# EAGLE schematic Apple ii SCSI VDEV2 (EAGLE 9.6.2)
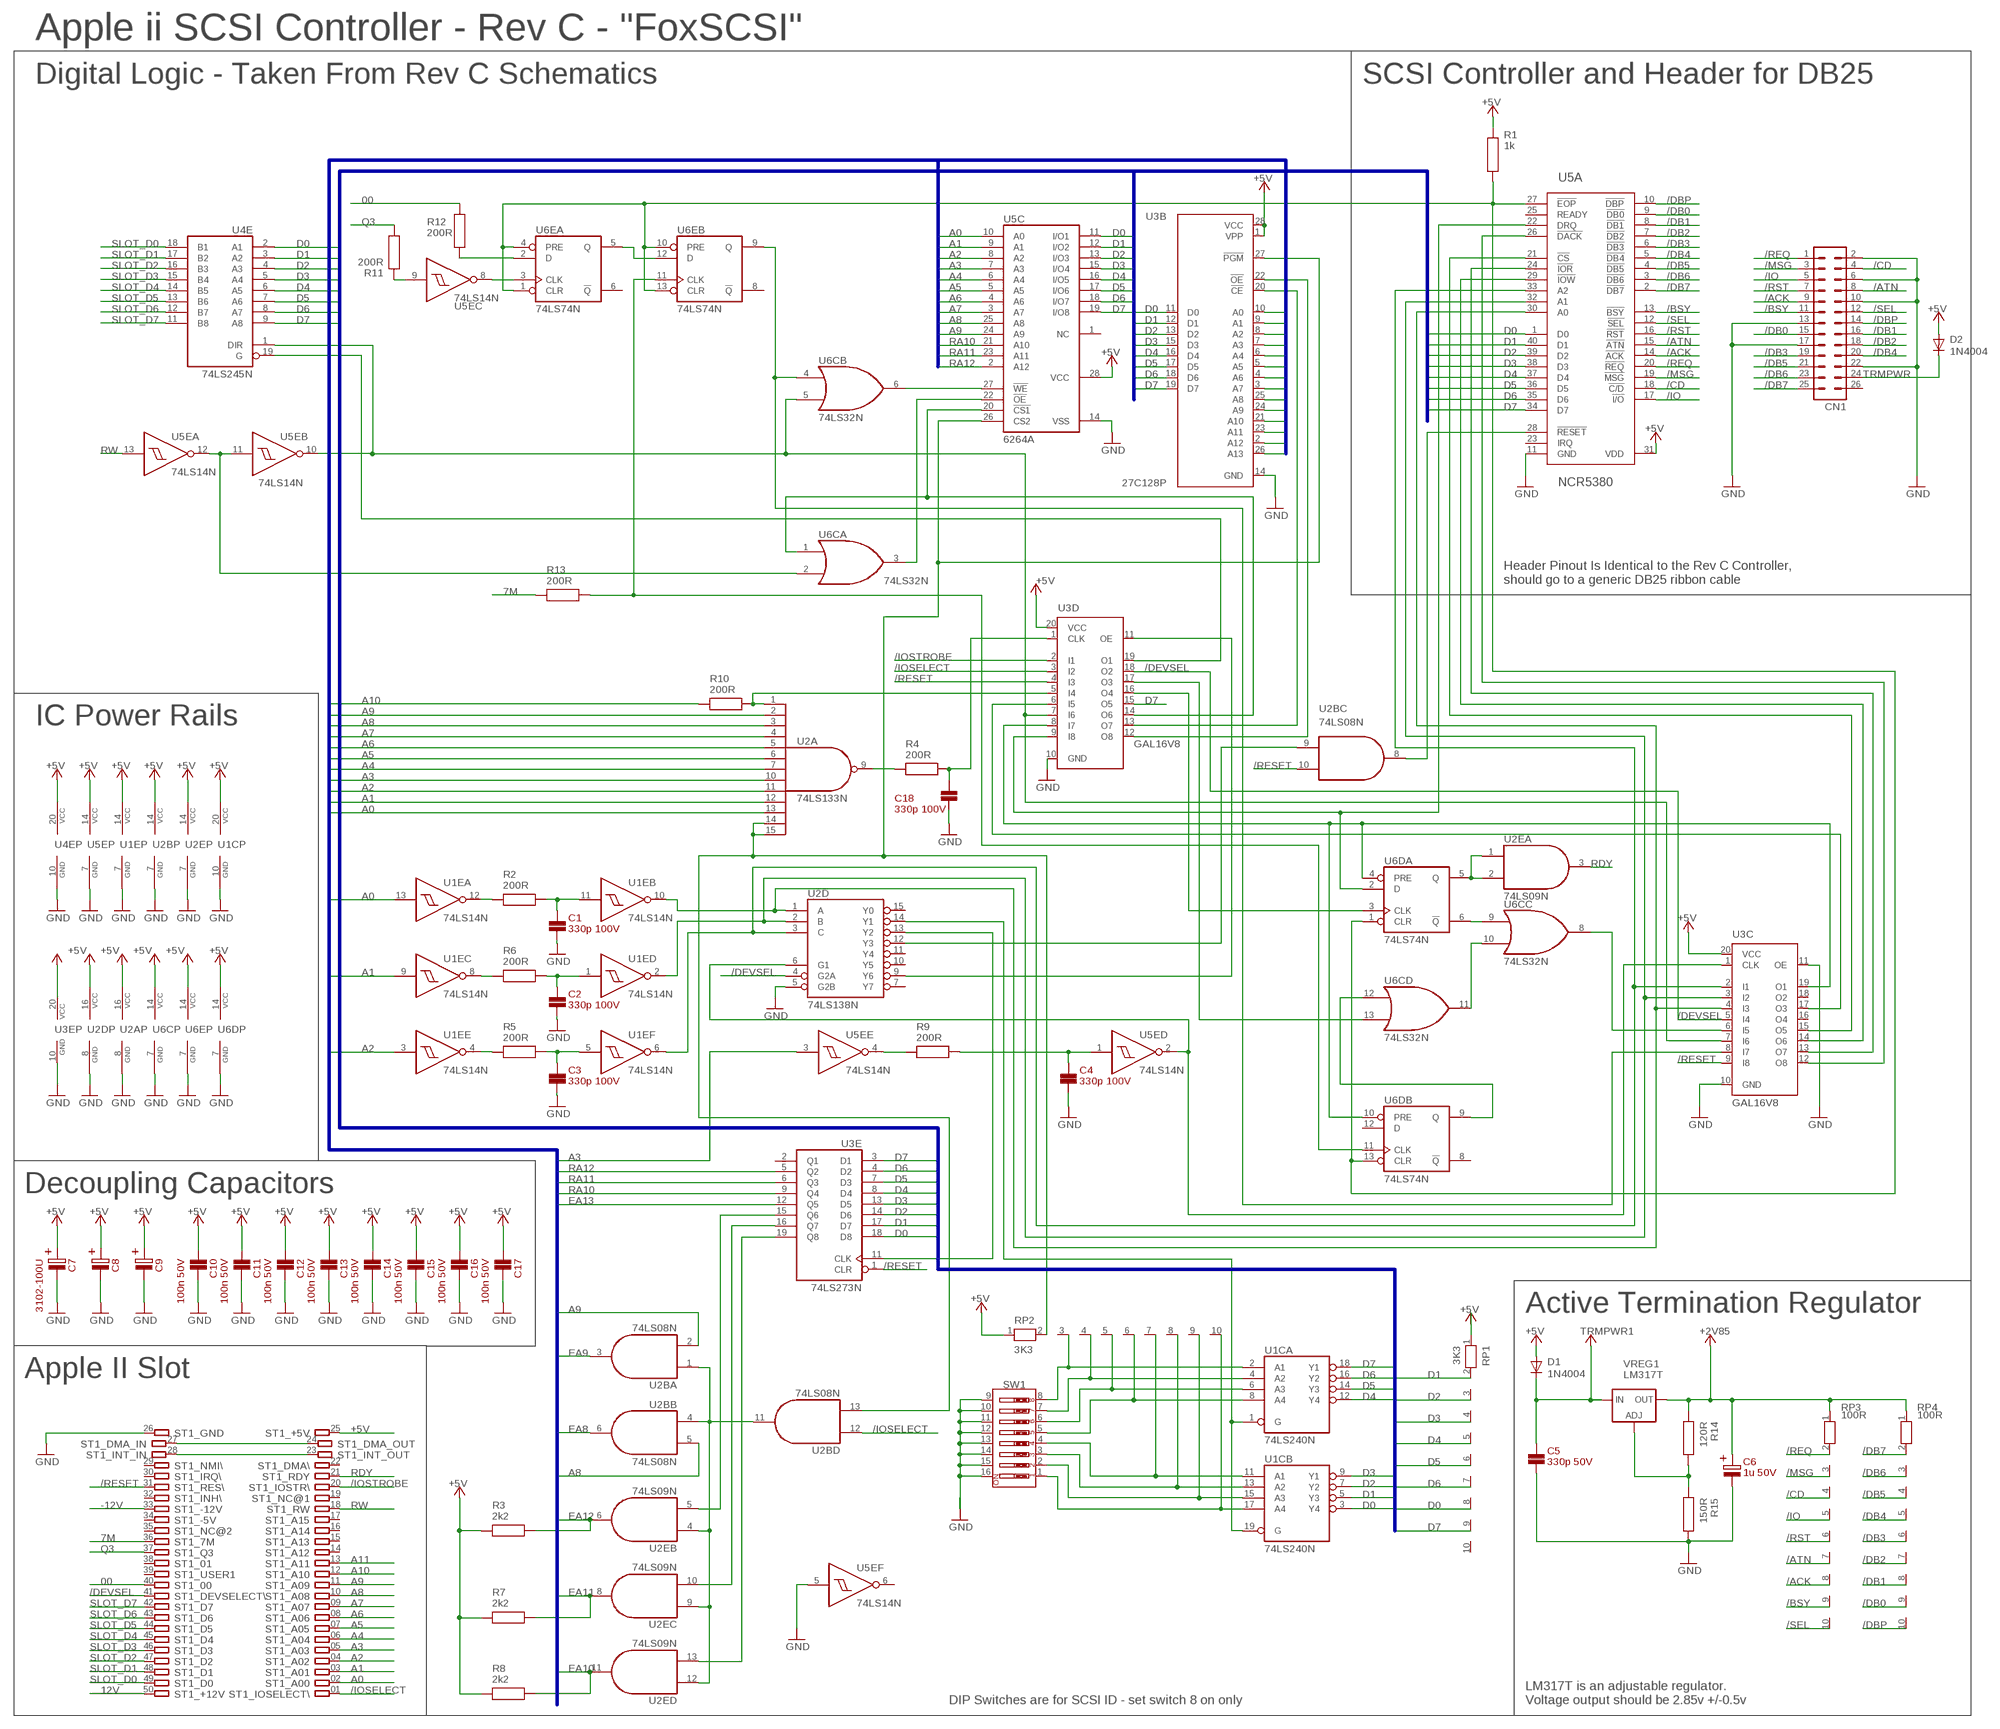
[diagram p0: schematic, sheet 1, part 1 of 2]
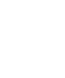
[diagram p1: schematic, sheet 1, part 2 of 2]

## Parts
C1  330p 100V  33P_TH_CAP  [CAP_5.08MM_PITCH]
C2  330p 100V  33P_TH_CAP  [CAP_5.08MM_PITCH]
C3  330p 100V  33P_TH_CAP  [CAP_5.08MM_PITCH]
C4  330p 100V  33P_TH_CAP  [CAP_5.08MM_PITCH]
C5  330p 50V  330P_TH_CAP  [CAP_5.08MM_PITCH]
C6  1u 50V  1U_TH_ELEC_CAPHORIZONTAL  [CAP_ELECTROLYTIC_FLAT]
C7  3102-100U  100U_TH_ELEC_CAPHORIZONTAL  [CAP_ELECTROLYTIC_FLAT]
C8  10U_TH_ELEC_CAPHORIZONTAL  [CAP_ELECTROLYTIC_FLAT]
C9  10U_TH_ELEC_CAPHORIZONTAL  [CAP_ELECTROLYTIC_FLAT]
C10  100n 50V  100N_TH_CAP  [CAP_5.08MM_PITCH]
C11  100n 50V  100N_TH_CAP  [CAP_5.08MM_PITCH]
C12  100n 50V  100N_TH_CAP  [CAP_5.08MM_PITCH]
C13  100n 50V  100N_TH_CAP  [CAP_5.08MM_PITCH]
C14  100n 50V  100N_TH_CAP  [CAP_5.08MM_PITCH]
C15  100n 50V  100N_TH_CAP  [CAP_5.08MM_PITCH]
C16  100n 50V  100N_TH_CAP  [CAP_5.08MM_PITCH]
C17  100n 50V  100N_TH_CAP  [CAP_5.08MM_PITCH]
C18  330p 100V  33P_TH_CAP  [CAP_5.08MM_PITCH]
CN1  MA13-2  [MA13-2]
D1  1N4004  [DO41-10]
D2  1N4004  [DO41-10]
R1  1k  1K_TH_RESISTOR  [RESISTORTHRUHOLE]
R2  200R  100R_TH_RESISTOR  [RESISTORTHRUHOLE]
R3  2k2  2K2_TH_RESISTOR  [RESISTORTHRUHOLE]
R4  200R  100R_TH_RESISTOR  [RESISTORTHRUHOLE]
R5  200R  100R_TH_RESISTOR  [RESISTORTHRUHOLE]
R6  200R  100R_TH_RESISTOR  [RESISTORTHRUHOLE]
R7  2k2  2K2_TH_RESISTOR  [RESISTORTHRUHOLE]
R8  2k2  2K2_TH_RESISTOR  [RESISTORTHRUHOLE]
R9  200R  100R_TH_RESISTOR  [RESISTORTHRUHOLE]
R10  200R  100R_TH_RESISTOR  [RESISTORTHRUHOLE]
R11  200R  100R_TH_RESISTOR  [RESISTORTHRUHOLE]
R12  200R  100R_TH_RESISTOR  [RESISTORTHRUHOLE]
R13  200R  100R_TH_RESISTOR  [RESISTORTHRUHOLE]
R14  120R  100R_TH_RESISTOR  [RESISTORTHRUHOLE]
R15  150R  100R_TH_RESISTOR  [RESISTORTHRUHOLE]
RP1  3K3  RN09  [RN-10]
RP2  3K3  RN09  [RN-10]
RP3  100R  RN09  [RN-10]
RP4  100R  RN09  [RN-10]
ST1  A2-50PINMINI  [A2-50PIN-MINI]
SW1  DIP-08-PTH  [DIPSWITCH-08]
U1C  74LS240N  [DIL20]
U1E  74LS14N  [DIL14]
U2A  74LS133N  74S133N  [DIL16]
U2B  74LS08N  [DIL14]
U2D  74LS138N  [DIL16]
U2E  74LS09N  [DIL14]
U3B  27C128P  [DIL28-6]
U3C  GAL16V8  ATF16V8BP3  [DIL20]
U3D  GAL16V8  ATF16V8BP3  [DIL20]
U3E  74LS273N  74273N  [DIL20]
U4E  74LS245N  [DIL20]
U5A  NCR5380  [DIP40]
U5C  6264A  [DIL28-6]
U5E  74LS14N  [DIL14]
U6C  74LS32N  [DIL14]
U6D  74LS74N  [DIL14]
U6E  74LS74N  [DIL14]
VREG1  LM317T  LM317TL  [317TL]

## Nets
00: R12.P$2 ST1.40
7M: R13.P$1 ST1.36
12V: ST1.50
+2V85: C6.P$1 R14.P$1 RP3.1 RP4.1 VREG1.2(OUT) ; supply symbol labelled VCC
+5V: C7.P$1 C8.P$1 C9.P$1 C10.P$1 C11.P$1 C12.P$1 C13.P$1 C14.P$1 C15.P$1 C16.P$1 C17.P$1 D1.A D2.A R1.P$2 R3.P$1 R7.P$1 R8.P$1 RP1.1 RP2.1 ST1.25 U1C.20(P:VCC) U1E.14(P:VCC) U2A.16(VCC) U2B.14(P:VCC) U2D.16(VCC) U2E.14(P:VCC) U3B.1(VPP) U3B.28(VCC) U3C.20(VCC) U3D.20(VCC) U3E.20(VCC) U4E.20(VCC) U5A.31(VDD) U5C.28(VCC) U5E.14(P:VCC) U6C.14(P:VCC) U6D.14(P:VCC) U6E.14(P:VCC) ; supply symbol labelled VCC
-12V: ST1.33
/ACK: CN1.9 RP3.8 U5A.14(!ACK)
/ATN: CN1.8 RP3.7 U5A.15(!ATN)
/BSY: CN1.11 RP3.9 U5A.13(!BSY)
/CD: CN1.4 RP3.4 U5A.18(!C/D)
/DB0: CN1.15 RP4.9 U5A.9(!DB0)
/DB1: CN1.16 RP4.8 U5A.8(!DB1)
/DB2: CN1.18 RP4.7 U5A.7(!DB2)
/DB3: CN1.19 RP4.6 U5A.6(!DB3)
/DB4: CN1.20 RP4.5 U5A.5(!DB4)
/DB5: CN1.21 RP4.4 U5A.4(!DB5)
/DB6: CN1.23 RP4.3 U5A.3(!DB6)
/DB7: CN1.25 RP4.2 U5A.2(!DB7)
/DBP: CN1.14 RP4.10 U5A.10(!DBP)
/DEVSEL: ST1.41 U2D.4(G2A) U3C.5(I4) U3D.18(O2)
/IO: CN1.5 RP3.5 U5A.17(!I/O)
/IOSELECT: ST1.01 U2B.12(D:I0) U3D.3(I2)
/IOSTROBE: ST1.20 U3D.2(I1)
/MSG: CN1.3 RP3.3 U5A.19(!MSG)
/REQ: CN1.1 RP3.2 U5A.20(!REQ)
/RESET: ST1.31 U2B.10(C:I1) U3C.9(I8) U3D.4(I3) U3E.1(CLR)
/RST: CN1.7 RP3.6 U5A.16(!RST)
/SEL: CN1.12 RP3.10 U5A.12(!SEL)
A0: ST1.02 U1E.13(A:I) U2A.13(I10) U3B.10(A0) U5C.10(A0)
A1: ST1.03 U1E.9(C:I) U2A.12(I9) U3B.9(A1) U5C.9(A1)
A2: ST1.04 U1E.3(E:I) U2A.11(I8) U3B.8(A2) U5C.8(A2)
A3: ST1.05 U2A.10(I7) U3B.7(A3) U5C.7(A3) U5E.3(E:I)
A4: ST1.06 U2A.7(I6) U3B.6(A4) U5C.6(A4)
A5: ST1.07 U2A.6(I5) U3B.5(A5) U5C.5(A5)
A6: ST1.08 U2A.5(I4) U3B.4(A6) U5C.4(A6)
A7: ST1.09 U2A.4(I3) U3B.3(A7) U5C.3(A7)
A8: ST1.10 U2A.3(I2) U2B.5(B:I1) U5C.25(A8)
A9: ST1.11 U2A.2(I1) U2B.2(A:I1) U5C.24(A9)
A10: R10.P$1 ST1.12
A11: ST1.13
D0: RP1.8 U1C.3(B:Y4) U3B.11(D0) U3E.18(D8) U4E.2(A1) U5A.1(D0) U5C.11(I/O1)
D1: RP1.2 U1C.5(B:Y3) U3B.12(D1) U3E.17(D7) U4E.3(A2) U5A.40(D1) U5C.12(I/O2)
D2: RP1.3 U1C.7(B:Y2) U3B.13(D2) U3E.14(D6) U4E.4(A3) U5A.39(D2) U5C.13(I/O3)
D3: RP1.4 U1C.9(B:Y1) U3B.15(D3) U3E.13(D5) U4E.5(A4) U5A.38(D3) U5C.15(I/O4)
D4: RP1.5 U1C.12(A:Y4) U3B.16(D4) U3E.8(D4) U4E.6(A5) U5A.37(D4) U5C.16(I/O5)
D5: RP1.6 U1C.14(A:Y3) U3B.17(D5) U3E.7(D3) U4E.7(A6) U5A.36(D5) U5C.17(I/O6)
D6: RP1.7 U1C.16(A:Y2) U3B.18(D6) U3E.4(D2) U4E.8(A7) U5A.35(D6) U5C.18(I/O7)
D7: RP1.9 U1C.18(A:Y1) U3B.19(D7) U3D.15(O5) U3E.3(D1) U4E.9(A8) U5A.34(D7) U5C.19(I/O8)
EA8: U2B.6(B:O) U3B.25(A8)
EA9: U2B.3(A:O) U3B.24(A9)
EA10: R8.P$2 U2E.11(D:O) U3B.21(A10)
EA11: R7.P$2 U2E.8(C:O) U3B.23(A11)
EA12: R3.P$2 U2E.6(B:O) U3B.2(A12)
EA13: U3B.26(A13) U3E.12(Q5)
GND: C1.P$1 C2.P$1 C3.P$1 C4.P$1 C5.P$1 C6.P$2 C7.P$2 C8.P$2 C9.P$2 C10.P$2 C11.P$2 C12.P$2 C13.P$2 C14.P$2 C15.P$2 C16.P$2 C17.P$2 C18.P$1 CN1.2 CN1.6 CN1.10 CN1.13 CN1.17 CN1.22 R15.P$2 ST1.26 SW1.9 SW1.10 SW1.11 SW1.12 SW1.13 SW1.14 SW1.15 SW1.16 U1C.10(P:GND) U1E.7(P:GND) U2A.8(GND) U2B.7(P:GND) U2D.5(G2B) U2D.8(GND) U2E.7(P:GND) U3B.14(GND) U3C.10(GND) U3C.11(OE) U3D.10(GND) U3E.10(GND) U4E.10(GND) U5A.11(GND) U5C.14(VSS) U5E.5(F:I) U5E.7(P:GND) U6C.7(P:GND) U6D.7(P:GND) U6E.7(P:GND)
N$1: ST1.24 ST1.27
N$2: ST1.23 ST1.28
N$3: U5E.11(B:I) U5E.12(A:O) U6C.2(A:I1)
N$4: U2B.8(C:O) U5A.28(!RESET)
N$5: RP2.3 SW1.8 U1C.2(A:A1)
N$6: RP2.4 SW1.7 U1C.4(A:A2)
N$7: RP2.5 SW1.6 U1C.6(A:A3)
N$8: RP2.6 SW1.5 U1C.8(A:A4)
N$9: RP2.7 SW1.4 U1C.11(B:A1)
N$10: RP2.8 SW1.3 U1C.13(B:A2)
N$11: RP2.9 SW1.2 U1C.15(B:A3)
N$12: RP2.10 SW1.1 U1C.17(B:A4)
N$13: U2E.13(D:I1) U3E.19(Q8)
N$14: U2B.1(A:I0) U2B.4(B:I0) U2B.11(D:O) U2E.4(B:I0) U2E.9(C:I0) U2E.12(D:I0)
N$15: U2E.10(C:I1) U3E.16(Q7)
N$16: U2E.5(B:I1) U3E.15(Q6)
N$17: U1E.10(B:O) U2D.1(A) U3C.4(I3) U5A.30(A0)
N$18: U1E.2(D:O) U2D.2(B) U3C.3(I2) U5A.32(A1)
N$19: C18.P$2 R4.P$2 U3D.1(CLK)
N$20: C1.P$2 R2.P$2 U1E.11(B:I)
N$21: R2.P$1 U1E.12(A:O)
N$22: R6.P$1 U1E.8(C:O)
N$23: C2.P$2 R6.P$2 U1E.1(D:I)
N$24: C3.P$2 R5.P$2 U1E.5(F:I)
N$25: R5.P$1 U1E.4(E:O)
N$26: R9.P$1 U5E.4(E:O)
N$27: C4.P$2 R9.P$2 U5E.1(D:I)
N$28: R4.P$1 U2A.9(O)
N$29: R10.P$2 U2A.1(I0) U3D.5(I4)
N$30: U1E.6(F:O) U2D.3(C) U3C.2(I1) U5A.33(A2)
N$32: U3C.17(O3) U3D.6(I5)
N$33: U3C.8(I7) U6C.4(B:I0) U6E.9(B:Q)
N$34: U3C.19(O1) U3D.8(I7) U6D.4(A:PRE) U6D.10(B:PRE)
N$35: U3D.9(I8) U5A.22(DRQ) U6D.2(A:D)
N$36: U2D.9(Y6) U3D.11(OE)
N$37: U3B.22(!OE) U3D.12(O8)
N$38: U3B.20(!CE) U3D.13(O7)
N$39: U3D.14(O6) U5C.20(!CS1) U6C.1(A:I0)
N$40: U3D.16(O4) U6D.3(A:CLK)
N$41: U3D.17(O3) U6C.13(D:I1)
N$43: U3D.19(O1) U4E.19(G)
N$44: U2D.6(G1) U3C.1(CLK) U5E.2(D:O)
N$45: U2D.13(Y2) U3E.11(CLK)
N$46: U2B.9(C:I0) U2D.12(Y3)
N$47: U1C.1(A:G) U1C.19(B:G) U2D.14(Y1)
N$48: U2E.1(A:I0) U2E.2(A:I1) U6D.5(A:Q)
N$49: U3C.6(I5) U6C.8(C:O)
N$50: U6C.9(C:I0) U6D.6(A:!Q)
N$51: U6C.10(C:I1) U6C.11(D:O)
N$52: U6C.12(D:I0) U6D.9(B:Q)
N$53: R1.P$1 U5A.27(!EOP) U6D.1(A:CLR) U6D.13(B:CLR) U6E.1(A:CLR) U6E.4(A:PRE) U6E.10(B:PRE) U6E.13(B:CLR)
N$54: R13.P$2 U6D.11(B:CLK) U6E.11(B:CLK)
N$55: R11.P$2 U5E.9(C:I)
N$56: U3C.14(O6) U5A.29(!IOW)
N$57: U3C.13(O7) U5A.24(!IOR)
N$58: U3C.12(O8) U5A.26(!DACK)
N$59: U3C.7(I6) U3D.7(I6) U4E.1(DIR) U5E.10(B:O) U6C.5(B:I1)
N$60: U3C.15(O5) U5A.21(!CS)
N$61: U5E.8(C:O) U6E.3(A:CLK)
N$62: R12.P$1 U6E.2(A:D)
N$63: U6E.5(A:Q) U6E.12(B:D)
N$64: U5C.27(!WE) U6C.6(B:O)
N$65: U5C.22(!OE) U6C.3(A:O)
N$66: RP2.2 U2A.14(I11) U2A.15(I12) U2B.13(D:I1) U3B.27(!PGM) U5C.26(CS2)
N$67: R14.P$2 R15.P$1 VREG1.1(ADJ)
Q3: R11.P$1 ST1.37
RA10: U3E.9(Q4) U5C.21(A10)
RA11: U3E.6(Q3) U5C.23(A11)
RA12: U3E.5(Q2) U5C.2(A12)
RDY: ST1.21 U2E.3(A:O)
RW: ST1.18 U5E.13(A:I)
SLOT_D0: ST1.49 U4E.18(B1)
SLOT_D1: ST1.48 U4E.17(B2)
SLOT_D2: ST1.47 U4E.16(B3)
SLOT_D3: ST1.46 U4E.15(B4)
SLOT_D4: ST1.45 U4E.14(B5)
SLOT_D5: ST1.44 U4E.13(B6)
SLOT_D6: ST1.43 U4E.12(B7)
SLOT_D7: ST1.42 U4E.11(B8)
TRMPWR: CN1.24 D2.C
TRMPWR1: C5.P$2 D1.C VREG1.3(IN) ; supply symbol labelled VCC
Unconnected: CN1.26 RP1.10 ST1.14 ST1.15 ST1.16 ST1.17 ST1.19 ST1.22 ST1.29 ST1.30 ST1.32 ST1.34 ST1.35 ST1.38 ST1.39 U2D.7(Y7) U2D.10(Y5) U2D.11(Y4) U2D.15(Y0) U3C.16(O4) U3C.18(O2) U3E.2(Q1) U5A.23(IRQ) U5A.25(READY) U5C.1(NC) U5E.6(F:O) U6D.8(B:!Q) U6D.12(B:D) U6E.6(A:!Q) U6E.8(B:!Q)

## Buses
D0,D1,D2,D3,D4,D5,D6,D7
A0,A1,A2,A3,A4,A5,A6,A7,A8,A9,A10,A11,EA8,EA9,EA10,EA11,EA12,EA13,RA10,RA11,RA12

## Notes on the sheet
- Apple ii SCSI Controller - Rev C - "FoxSCSI"
- Digital Logic - Taken From Rev C Schematics | SCSI Controller and Header for DB25
- Header Pinout Is Identical to the Rev C Controller,
  should go to a generic DB25 ribbon cable
- IC Power Rails
- Decoupling Capacitors
- Active Termination Regulator
- Apple II Slot
- DIP Switches are for SCSI ID - set switch 8 on only
- LM317T is an adjustable regulator. 
  Voltage output should be 2.85v +/-0.5v

## Library data of the parts
C1-C4 C18 = Capacitors TH:33P_TH_CAP; COMPONENT: Capacitor; COST: =(INDIRECT(ADDRESS(ROW(),1)))*(INDIRECT(ADDRESS(ROW(),13))); EA: =VLOOKUP(INDIRECT(ADDRESS(ROW(),7)),[ProductCosts.xlsx]StockCosts!$A:$B,2,FALSE); KPN: 3101-33P; PACKAGE: 5.08mm PITCH; PROCESS: TH; VALUE: 33p 100V
C5 = Capacitors TH:330P_TH_CAP; COMPONENT: Capacitor; COST: =(INDIRECT(ADDRESS(ROW(),1)))*(INDIRECT(ADDRESS(ROW(),13))); EA: =VLOOKUP(INDIRECT(ADDRESS(ROW(),7)),[ProductCosts.xlsx]StockCosts!$A:$B,2,FALSE); KPN: 3101-330P; PACKAGE: 5.08mm PITCH; PROCESS: TH
C6 = Capacitors TH:1U_TH_ELEC_CAP; COMPONENT: Capacitor Electrolytic; COST: =(INDIRECT(ADDRESS(ROW(),1)))*(INDIRECT(ADDRESS(ROW(),13))); EA: =VLOOKUP(INDIRECT(ADDRESS(ROW(),7)),[ProductCosts.xlsx]StockCosts!$A:$B,2,FALSE); KPN: 3102-1U; PACKAGE: 6mm Dia; PROCESS: TH
C7 = Capacitors TH:100U_TH_ELEC_CAP; COMPONENT: Capacitor Electrolytic; COST: =(INDIRECT(ADDRESS(ROW(),1)))*(INDIRECT(ADDRESS(ROW(),13))); EA: =VLOOKUP(INDIRECT(ADDRESS(ROW(),7)),[ProductCosts.xlsx]StockCosts!$A:$B,2,FALSE); KPN: 3102-100U; PACKAGE: 5mm Dia; PROCESS: TH
C8 C9 = Capacitors TH:10U_TH_ELEC_CAP
C10-C17 = Capacitors TH:100N_TH_CAP; COMPONENT: Capacitor; COST: =(INDIRECT(ADDRESS(ROW(),1)))*(INDIRECT(ADDRESS(ROW(),13))); EA: =VLOOKUP(INDIRECT(ADDRESS(ROW(),7)),[ProductCosts.xlsx]StockCosts!$A:$B,2,FALSE); KPN: 3101-100N; PACKAGE: 5.08mm PITCH; PROCESS: TH
CN1 = con-lstb:MA13-2: PIN HEADER; OC_FARNELL: unknown; OC_NEWARK: unknown
D1 D2 = adafruit:1N4004: DIODE General purpose 1N400x type rectifier (With bigger pads) http://www.ladyada.net/library/pcb/eaglelibrary.html
R1 = Resistors TH:1K_TH_RESISTOR; COMPONENT: Resistor; COST: =(INDIRECT(ADDRESS(ROW(),1)))*(INDIRECT(ADDRESS(ROW(),13))); EA: =(VLOOKUP(INDIRECT(ADDRESS(ROW(),6)),[ProductCosts.xlsx]StockCosts!$A:$B,2,FALSE))/1000; KPN: 3004-1k; PACKAGE: Axial Leaded; PROCESS: TH
R2 R4-R6 R9-R15 = Resistors TH:100R_TH_RESISTOR; COMPONENT: Resistor; COST: =(INDIRECT(ADDRESS(ROW(),1)))*(INDIRECT(ADDRESS(ROW(),13))); EA: =(VLOOKUP(INDIRECT(ADDRESS(ROW(),6)),[ProductCosts.xlsx]StockCosts!$A:$B,2,FALSE))/1000; KPN: 3004-100R; PACKAGE: Axial Leaded; PROCESS: TH; VALUE: 100R
R3 R7 R8 = Resistors TH:2K2_TH_RESISTOR; COMPONENT: Resistor; COST: =(INDIRECT(ADDRESS(ROW(),1)))*(INDIRECT(ADDRESS(ROW(),13))); EA: =(VLOOKUP(INDIRECT(ADDRESS(ROW(),6)),[ProductCosts.xlsx]StockCosts!$A:$B,2,FALSE))/1000; KPN: 3004-2k2; PACKAGE: Axial Leaded; PROCESS: TH
RP1-RP4 = resistor-net:RN09: RESISTOR NETWORK; OC_FARNELL: unknown; OC_NEWARK: unknown
ST1 = con-apple2:A2-50PIN: Apple ][ Peripheral Card Connector This is the, default, 50-pin connector for slot #1 to #7 Pins are laid out as seen from the top of the slot
SW1 = SparkFun-Switches:DIP-08: 8-Position DIP Switch 8-circuit DIP (dual inline package) switch. Commonly used to physcially set a circuit's behavior. SparkFun Products DIP Switch - 8 Position <https://www.sparkfun.com/products/8034> (COM-08034); PROD_ID: SWCH-12197; SF_SKU: COM-08034
U1C = 74xx-us:74*240: Octal BUFFER and LINE DRIVER, 3-state
U1E U5E = 74xx-us:74*14: Hex schmitt trigger INVERTER
U2A = 74xx-us:74*133: 13-input NAND gate
U2B = 74xx-us:74*08: Quad 2-input AND gate
U2D = 74xx-us:74*138: 3-line to 8-line DECODER/DEMULTIPLEXER
U2E = 74xx-us:74*09: Quad 2-input AND gate, open collector
U3B = microchip:27*128: CMOS EPROM 128 K (16 K x 8); OC_FARNELL: unknown; OC_NEWARK: unknown
U3C U3D = atmel:ATF16V8B: High perfomance CMOS (electrically erasable) programmable logic device (PLD) ABLE-Atmel-ABEL - P18V8R, P16V8C, P16V8AS, P17V8 COPL Atmel-WinCUPL - G16V8MS, G16V8MA, G16V8AS, G16V8 LOG/IC - GAL16V8_R, GAL16V8_G7, GAL16V8_C), GAL16V8 Tango-PLD - G16V8R, G16V8C, G16V8AS, G16V8 Source: http://www.atmel.com/dyn/resources/prod_documents/DOC0364.PDF; MPN: ATF16V8CZ-15PU; OC_FARNELL: 1551768; OC_NEWARK: 94M6254
U3E = 74xx-eu:74*273: Octal D type FLIP FLOP, clear
U4E = 74xx-us:74*245: Octal BUS TRANSCEIVER, 3-state
U5A = ICs:NCR5380
U5C = memory-hitachi:6264A: MEMORY; OC_FARNELL: 283605; OC_NEWARK: unknown
U6C = 74xx-us:74*32: Quad 2-input OR gate
U6D U6E = 74xx-us:74*74: Dual D type positive edge triggered FLIP FLOP, preset and clear
VREG1 = v-reg:LM317TL: VOLTAGE REGULATOR

## Net classes
1 thick: width 0.381 mm